# EAGLE design 27C160_Adapter (EAGLE 7.5.0)
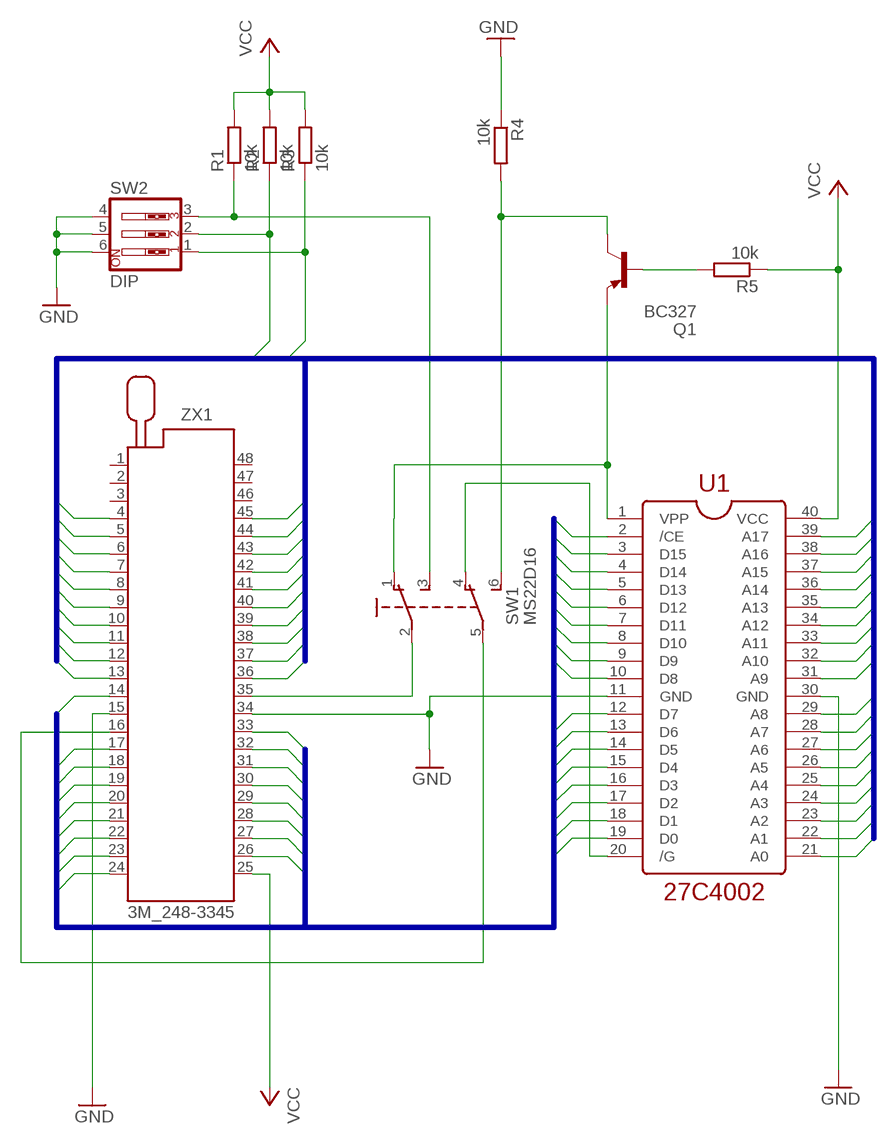
[diagram p0: schematic, sheet 1]

## Parts
Q1  BC327  [TO92-EBC]
R1  10k  R-EU_0207/10  [0207/10]
R2  10k  R-EU_0207/10  [0207/10]
R3  10k  R-EU_0207/10  [0207/10]
R4  10k  R-EU_0207/10  [0207/10]
R5  10k  R-EU_0207/10  [0207/10]
SW1  MS22D16  [MS22D16]
SW2  DIP  SW_DIP-3  [EDG-03]
U1  27C4002  [27C4002]
ZX1  3M_248-3345  [3M_248-3345]

## Nets
A0: U1.21(A0) ZX1.13
A1: U1.22(A1) ZX1.12
A2: U1.23(A2) ZX1.11
A3: U1.24(A3) ZX1.10
A4: U1.25(A4) ZX1.9
A5: U1.26(A5) ZX1.8
A6: U1.27(A6) ZX1.7
A7: U1.28(A7) ZX1.6
A8: U1.29(A8) ZX1.44
A9: U1.31(A9) ZX1.43
A10: U1.32(A10) ZX1.42
A11: U1.33(A11) ZX1.41
A12: U1.34(A12) ZX1.40
A13: U1.35(A13) ZX1.39
A14: U1.36(A14) ZX1.38
A15: U1.37(A15) ZX1.37
A16: U1.38(A16) ZX1.36
A17: U1.39(A17) ZX1.5
A18: R3.1 SW2.1 ZX1.4
A19: R2.1 SW2.2 ZX1.45
A20: R1.1 SW1.3(S) SW2.3
D0: U1.19(D0) ZX1.17
D1: U1.18(D1) ZX1.19
D2: U1.17(D2) ZX1.21
D3: U1.16(D3) ZX1.23
D4: U1.15(D4) ZX1.26
D5: U1.14(D5) ZX1.28
D6: U1.13(D6) ZX1.30
D7: U1.12(D7) ZX1.32
D8: U1.10(D8) ZX1.18
D9: U1.9(D9) ZX1.20
D10: U1.8(D10) ZX1.22
D11: U1.7(D11) ZX1.24
D12: U1.6(D12) ZX1.27
D13: U1.5(D13) ZX1.29
D14: U1.4(D14) ZX1.31
D15: U1.3(D15) ZX1.33
E: U1.2(/CE) ZX1.14
GND: R4.1 SW2.4 SW2.5 SW2.6 U1.11(GND) U1.30(GND) ZX1.15 ZX1.34
N$1: Q1.B R5.2
N$2: SW1.2(P) ZX1.35
N$4: Q1.C R4.2 SW1.6(S1)
N$5: SW1.4(O1) U1.20(/G)
N$6: SW1.5(P1) ZX1.16
VCC: R1.2 R2.2 R3.2 R5.1 U1.40(VCC) ZX1.25
VPP: Q1.E SW1.1(O) U1.1(VPP)
Unconnected: ZX1.1 ZX1.2 ZX1.3 ZX1.46 ZX1.47 ZX1.48

## Buses
A[0..19]
D[0..15],E

## Library data of the parts
Q1 = transistor-pnp:BC327*: PNP Transistror
R1-R5 = rcl:R-EU_: RESISTOR, European symbol
SW1 = gaggi:MS22D16
SW2 = special:SW_DIP-3: DIP SWITCH
U1 = gaggi:27C4002
ZX1 = gaggi:3M_248-3345: Zero Insertion Force Socked Source: http://www.3M.com/ehpd; MF: 3M; MPN: 248-1282-00-0602J; OC_FARNELL: 9897488; OC_NEWARK: 85K7866

## Net classes
1 Supply: width 0.61 mm

## Board
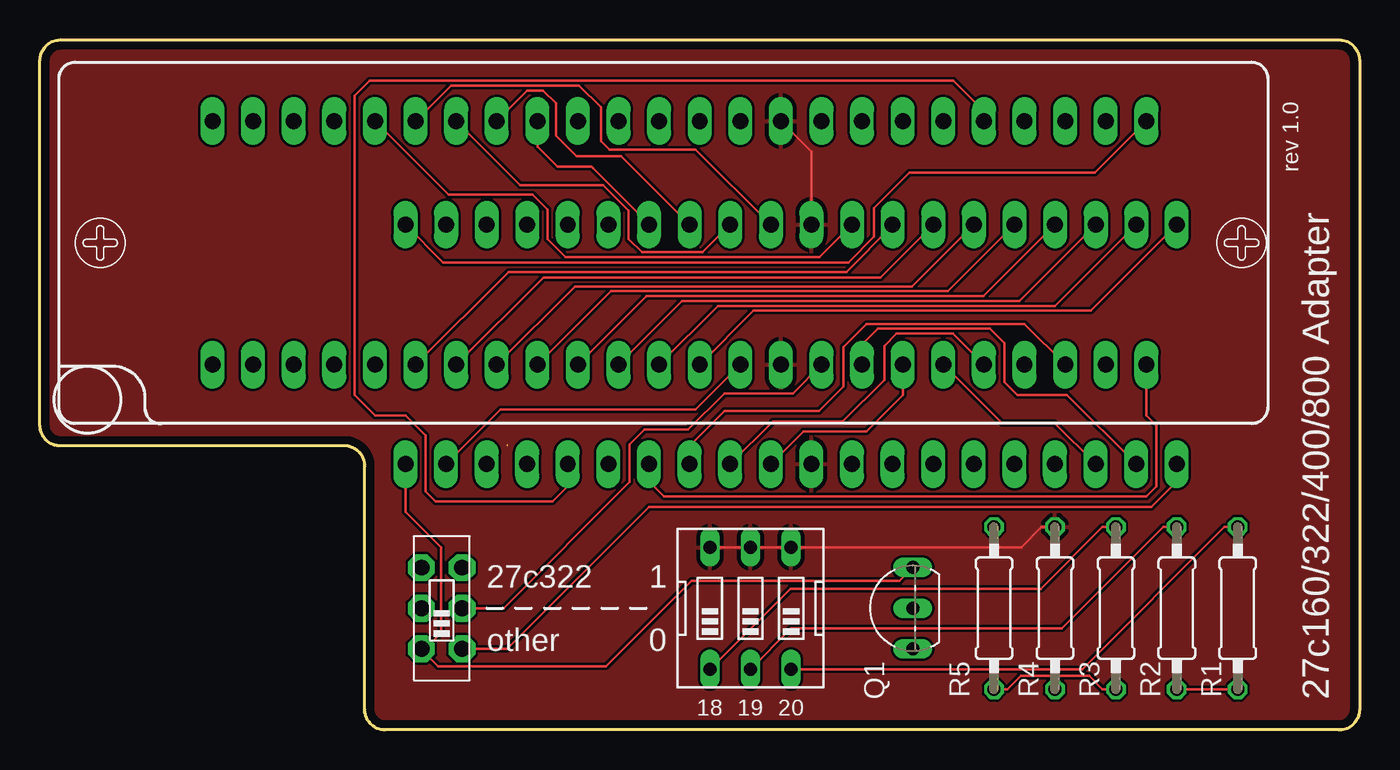
[diagram p1: board, top side]
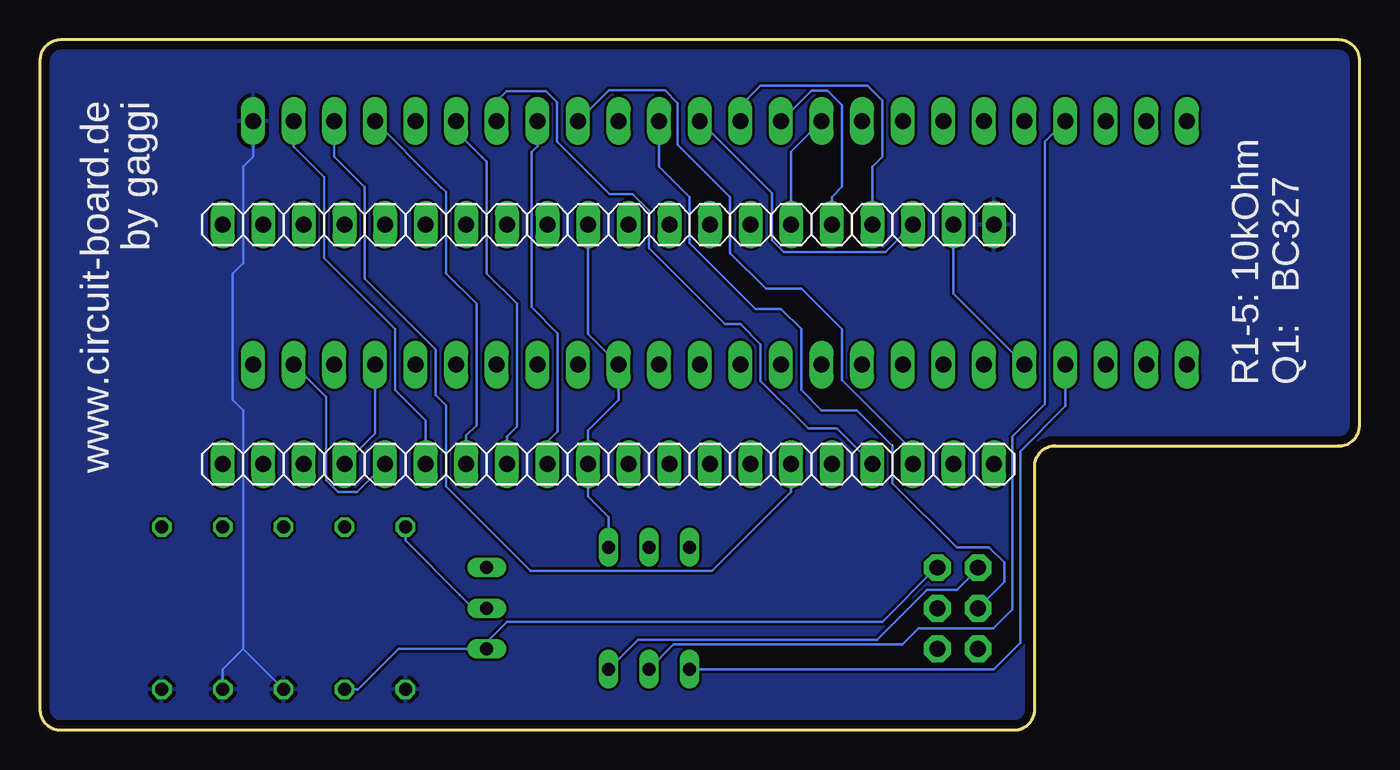
[diagram p2: board, bottom side, seen from below]

Size 82.55 x 43.18 mm. Coordinates in mm from the lower left corner, seen from the top.
Outline: 1.27,43.18 81.28,43.18 arc-90 82.55,41.91 82.55,1.27 arc-90 81.28,0 21.59,0 arc-90 20.32,1.27 20.32,16.51 arc90 19.05,17.78 1.27,17.78 arc-90 0,19.05 0,41.91 arc-90 1.27,43.18
Copper layers (1*16): Top 0.035mm / dielectric 1.6mm / Bottom 0.035mm
Design rules "Elecrow_2-layer_PCB_eagle_rule": minimum track width 6mil, minimum drill 12mil, track to track 6mil, track to pad 6mil, pad to pad 6mil, via to via 8mil, smd to smd 0mil, copper to edge 20mil, drill to drill 10mil, minimum pad ring 6mil, minimum via ring 6mil, stop-mask expansion 0mil, vias tented up to drill 100mil, thermal gap 10mil

### Footprints (pad centres in the part's own frame; a part is rotated, then mirrored left to right if it is on the bottom)
TO92-EBC = drill 0.813 long: B 0,-1.27; C -2.54,-1.27; E 2.54,-1.27
0207/10 = drill 0.813 octagon: 1 -5.08,0; 2 5.08,0
MS22D16 = drill 1 pad 1.676 octagon: 1 -2.54,1.27; 2 0,1.27; 3 2.54,1.27; 4 -2.54,-1.27; 5 0,-1.27; 6 2.54,-1.27
EDG-03 = drill 0.813 long: 1 -2.54,-3.81; 2 0,-3.81; 3 2.54,-3.81; 4 2.54,3.81; 5 0,3.81; 6 -2.54,3.81
27C4002 = drill 1 long: 1 -22.86,-7.495; 2 -20.32,-7.495; 3 -17.78,-7.495; 4 -15.24,-7.495; 5 -12.7,-7.495; 6 -10.16,-7.495; 7 -7.62,-7.495; 8 -5.08,-7.495; 9 -2.54,-7.495; 10 0,-7.495; 11 2.54,-7.495; 12 5.08,-7.495; 13 7.62,-7.495; 14 10.16,-7.495; 15 12.7,-7.495; 16 15.24,-7.495; 17 17.78,-7.495; 18 20.32,-7.495; 19 22.86,-7.495; 20 25.4,-7.495; 21 25.4,7.495; 22 22.86,7.495; 23 20.32,7.495; 24 17.78,7.495; 25 15.24,7.495; 26 12.7,7.495; 27 10.16,7.495; 28 7.62,7.495; 29 5.08,7.495; 30 2.54,7.495; 31 0,7.495; 32 -2.54,7.495; 33 -5.08,7.495; 34 -7.62,7.495; 35 -10.16,7.495; 36 -12.7,7.495; 37 -15.24,7.495; 38 -17.78,7.495; 39 -20.32,7.495; 40 -22.86,7.495
3M_248-3345 = drill 1 long: 1 -32.385,-7.62; 2 -29.845,-7.62; 3 -27.305,-7.62; 4 -24.765,-7.62; 5 -22.225,-7.62; 6 -19.685,-7.62; 7 -17.145,-7.62; 8 -14.605,-7.62; 9 -12.065,-7.62; 10 -9.525,-7.62; 11 -6.985,-7.62; 12 -4.445,-7.62; 13 -1.905,-7.62; 14 0.635,-7.62; 15 3.175,-7.62; 16 5.715,-7.62; 17 8.255,-7.62; 18 10.795,-7.62; 19 13.335,-7.62; 20 15.875,-7.62; 21 18.415,-7.62; 22 20.955,-7.62; 23 23.495,-7.62; 24 26.035,-7.62; 25 26.035,7.62; 26 23.495,7.62; 27 20.955,7.62; 28 18.415,7.62; 29 15.875,7.62; 30 13.335,7.62; 31 10.795,7.62; 32 8.255,7.62; 33 5.715,7.62; 34 3.175,7.62; 35 0.635,7.62; 36 -1.905,7.62; 37 -4.445,7.62; 38 -6.985,7.62; 39 -9.525,7.62; 40 -12.065,7.62; 41 -14.605,7.62; 42 -17.145,7.62; 43 -19.685,7.62; 44 -22.225,7.62; 45 -24.765,7.62; 46 -27.305,7.62; 47 -29.845,7.62; 48 -32.385,7.62

### Placement (x,y rotation side)
Q1  53.34,7.62 90 top
R1  74.93,7.62 270 top
R2  71.12,7.62 270 top
R3  67.31,7.62 270 top
R4  63.5,7.62 270 top
R5  59.69,7.62 90 top
SW1  25.13,7.62 90 top
SW2  44.45,7.62 0 top
U1  45.72,24.13 0 top
ZX1  43.18,30.48 0 top

### Tracks (layer width: path | path; a pad name or v marks a point on that pad's centre or on a via)
A0
  Top 0.152: ZX1.13 44.65,26.23 65.73,26.23 U1.21
A1
  Top 0.152: ZX1.12 42.41,26.54 63.49,26.54 U1.22
A2
  Top 0.152: ZX1.11 40.18,26.84 61.26,26.84 U1.23
A3
  Top 0.152: ZX1.10 37.94,27.15 59.02,27.15 U1.24
A4
  Top 0.152: ZX1.9 35.71,27.45 56.79,27.45 U1.25
A5
  Top 0.152: ZX1.8 33.47,27.76 54.55,27.76 U1.26
A6
  Top 0.152: U1.27 52.58,28.32 31.5,28.32 ZX1.7
A7
  Top 0.152: U1.28 53.34,31.55 50.46,28.66 29.3,28.66 ZX1.6
A8
  Top 0.152: ZX1.44 25.56,33.5 30.81,33.5 31.75,32.56 31.75,30.73 32.89,29.59 48.76,29.59 U1.29
A9
  Top 0.152: ZX1.43 25.71,40.32 33.73,40.32 35.1,38.96 35.1,36.85 35.62,36.32 41.02,36.32 U1.31
A10
  Top 0.152: U1.32 41.45,29.89 37.66,29.89 36.83,30.73 36.83,32.5 35.23,34.09 30.04,34.09 ZX1.42
A11
  Top 0.152: ZX1.41 30.48,40.01 31.48,40.01 32.28,39.21 32.28,37.19 33.56,35.91 36.35,35.91 U1.33
A12
  Top 0.152: U1.34 38.1,31.66 34.6,35.15 34.52,35.24 32.38,35.24 31.11,36.51 ZX1.40
A13
  Bottom 0.152: ZX1.39 35.56,36.2 U1.35
A14
  Bottom 0.152: U1.36 33.02,33.35 32.38,33.99 32.38,39.1 33.28,40 34.29,40 ZX1.38
A15
  Bottom 0.152: ZX1.37 38.73,39.05 37.47,40.32 30.8,40.32 29.84,39.37 29.84,35.88 30.48,35.24 U1.37
A16
  Bottom 0.152: ZX1.36 36.76,33.58 36.76,30.64 36.01,29.89 29.67,29.89 U1.38
A17
  Bottom 0.152: ZX1.5 25.4,27.3 U1.39
A18
  Top 0.152: R3.1 66.47,12.7 62.62,8.85 46.95,8.85 SW2.1
  Bottom 0.152: ZX1.4 18.41,20.26 21.23,17.44 21.23,5.45 22.87,3.81 SW2.1
A19
  Top 0.152: R2.1 70.28,12.7 63.93,6.35 46.99,6.35 SW2.2
  Bottom 0.152: ZX1.45 19.68,36.83 19.68,20.4 21.72,18.37 21.72,7.55 22.91,6.35 27.59,6.35 28.58,5.35 42.91,5.35 SW2.2
A20
  Top 0.152: R1.1 74.09,12.7 65.2,3.81 SW2.3
  Bottom 0.152: SW1.3 23.93,10.16 23.93,10.03 25.18,8.78 27.06,8.78 30.18,5.66 45.14,5.66 SW2.3
D0
  Top 0.152: U1.19 64.25,20.96 61.15,20.96 60.33,21.79 60.33,24.22 59.43,25.11 53.05,25.11 52.41,25.11 51.44,24.13 ZX1.17
D1
  Top 0.152: ZX1.19 60.17,19.2 63.48,19.2 U1.18
D2
  Bottom 0.152: ZX1.21 61.59,21.28 61.59,18.54 U1.17
D3
  Bottom 0.152: U1.16 62.7,14.89 63.9,14.89 64.66,15.66 64.66,20.85 ZX1.23
D4
  Bottom 0.152: ZX1.26 66.67,36.51 64.77,34.61 64.77,32.7 64.77,29.53 60.33,25.08 60.33,21.27 58.42,19.37 U1.15
D5
  Bottom 0.152: 57.44,33.95 57.78,34.29 | 57.78,34.29 ZX1.28 | U1.14 55.88,18.36 55.88,18.41 55.24,19.05 55.24,26.67 57.15,28.57 57.15,33.66 57.78,34.29
D6
  Bottom 0.152: U1.13 53.34,18.36 52.7,19 52.7,26.67 54.61,28.57 54.61,34.61 54.61,35.56 54.9,35.85 56.52,37.47 ZX1.30
D7
  Bottom 0.152: U1.12 50.8,18.05 50.16,18.68 50.16,24.81 51.81,26.46 51.81,36.15 51.44,36.52 ZX1.32
D8
  Top 0.152: U1.10 47.78,18.69 49.81,18.69 51.71,18.69 53.98,20.95 ZX1.18
D9
  Top 0.152: ZX1.20 57.11,24.8 53.57,24.8 52.81,24.04 52.81,21.91 50.22,19.31 45.86,19.31 U1.9
D10
  Top 0.152: ZX1.22 61.58,25.41 51.72,25.41 50.26,23.95 50.26,21.48 48.74,19.97 42.83,19.97 40.64,17.78 U1.8
D11
  Top 0.152: ZX1.24 69.22,19.68 69.85,19.05 69.85,15.24 69.22,14.61 39.05,14.61 38.1,15.56 U1.7
D12
  Bottom 0.152: U1.6 35.56,14.91 40.52,9.95 51.34,9.95 51.86,9.95 57.15,15.24 57.15,20.32 57.78,20.95 57.78,23.81 62.23,28.26 62.23,32.07 62.23,33.97 64.14,35.88 ZX1.27
D13
  Top 0.152: ZX1.29 59.05,38.73 57.15,40.64 20.64,40.64 19.68,39.69 19.68,20.95 20.95,19.68 22.86,19.68 24.13,18.41 24.13,14.92 24.77,14.29 32.07,14.29 33.02,15.24 U1.5
D14
  Bottom 0.152: U1.4 32.7,18.85 34.49,18.85 37.47,21.83 37.47,22.54 37.47,24.13 38.73,25.4 39.69,25.4 44.45,30.16 44.45,30.39 44.45,32.5 45.47,33.52 46.9,33.52 50.21,36.83 50.21,39.29 50.91,39.98 53.36,39.98 53.98,39.37 ZX1.31
D15
  Bottom 0.152: ZX1.33 46.96,40.04 43.45,40.04 42.65,39.24 42.65,37.21 42.65,36.62 39.37,33.34 39.37,29.84 37.15,27.62 34.92,27.62 32.38,25.08 32.38,21.91 27.94,17.46 U1.3
E
  Top 0.152: ZX1.14 41,20.04 28.81,20.04 U1.2
GND
  Top 0.152: ZX1.34 48.26,36.2 U1.30 | SW2.6 SW2.5 SW2.4 61.39,11.43 62.66,12.7 R4.1
  Bottom 0.152: U1.30 48.26,24.77 ZX1.15 46.35,20.64 48.26,18.73 U1.11 48.26,14.61 46.99,13.34 SW2.4
  pour Top: -1.27,43.18 82.55,43.18 82.55,0 -1.27,0
N$1
  Bottom 0.152: R5.2 59.69,11.86 56.29,8.46 55.45,7.62 Q1.B
N$2  (1 unrouted)
  Bottom 0.152: SW1.2 22.23,9.26 22.23,10.48 23.18,11.43 24.13,11.43 25.2,11.43 29.21,15.44 29.21,17.78 31.43,20 33.66,20 34.92,21.27 34.92,25.08 36.2,26.35 37.78,26.35 41.91,30.48 41.91,33.34 43.81,35.24 43.81,37.47 ZX1.35
N$4
  Bottom 0.152: SW1.6 26.47,10.16 29.84,6.78 53.33,6.78 54.61,5.5 Q1.C 60.12,5.08 62.66,2.54 R4.2
N$5
  Top 0.152: SW1.4 29.21,5.08 38.1,13.97 69.53,13.97 71.12,15.56 U1.20
N$6
  Top 0.152: ZX1.16 47.1,21.06 42.82,21.06 40.56,18.8 37.81,18.8 36.89,17.87 36.89,15.51 29,7.62 26.47,7.62 SW1.5
VCC
  Top 0.152: ZX1.25 65.98,34.87 54.38,34.87 52.18,32.66 52.18,30.87 50.57,29.26 25.23,29.26 U1.40 | R5.1 60.53,2.54 61.37,3.38 65.63,3.38 66.47,2.54 R3.2 | R2.2 R1.2
  Bottom 0.152: R3.2 69.85,5.08 | 69.85,5.08 69.85,15.56 69.85,20 70.48,20.64 70.48,28.57 69.85,29.21 69.85,35.24 69.22,35.88 ZX1.25 | R2.2 71.12,3.81 69.85,5.08
  pour Bottom: -2.54,43.18 82.55,43.18 82.55,0 -2.54,0
VPP
  Top 0.152: Q1.E 53.77,9.32 40.74,9.32 35.4,3.98 24.89,3.98 23.86,5.01 SW1.1 24.08,5.08 25,6 25.08,6.08 25.08,11.43 22.86,13.65 U1.1

### Text on the board
tPlace: rev 1.0 | 27c322 | 1 | other | 0 | 18 | 19 | 20 | 27c160/322/400/800 Adapter
bPlace: by gaggi | www.circuit-board.de | R1-5: 10kOhm / Q1: BC327